# Altium schematic sheet WideRangeVoltmeter.SchDoc
size A4; SheetNumber: 1; SheetTotal: 7
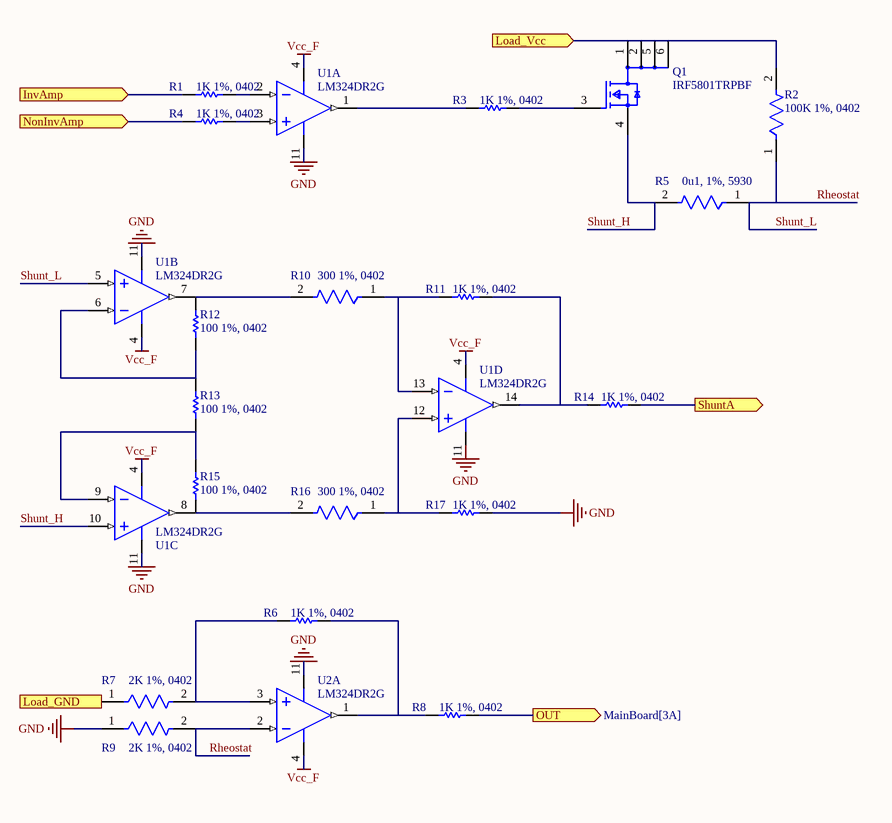
[diagram p0: WideRangeVoltmeter.SchDoc]

## Parts
Q1  IRF5801TRPBF  [FP-PG-TSOP-6-MFG]
R1  1K 1%, 0402  [RESC1005X40X25NL05T05]
R2  100K 1%, 0402  [FP-ERJ2RK-IPC_C]
R3  1K 1%, 0402  [RESC1005X40X25NL05T05]
R4  1K 1%, 0402  [RESC1005X40X25NL05T05]
R5  0u1, 1%, 5930  [FP-CSS2H-5930K-1L00F-MFG]
R6  1K 1%, 0402  [RESC1005X40X25NL05T05]
R7  2K 1%, 0402  [FP-ERJ2RK-MFG]
R8  1K 1%, 0402  [RESC1005X40X25NL05T05]
R9  2K 1%, 0402  [FP-ERJ2RK-MFG]
R10  300 1%, 0402  [FP-ERJ2RK-IPC_A]
R11  1K 1%, 0402  [RESC1005X40X25NL05T05]
R12  100 1%, 0402  [RESC1005X40X25LL05T05]
R13  100 1%, 0402  [RESC1005X40X25LL05T05]
R14  1K 1%, 0402  [RESC1005X40X25NL05T05]
R15  100 1%, 0402  [RESC1005X40X25LL05T05]
R16  300 1%, 0402  [FP-ERJ2RK-IPC_A]
R17  1K 1%, 0402  [RESC1005X40X25NL05T05]
U1  LM324DR2G  [ONSC-SOIC-14-751A-03_V]  (parts A,B,C,D of 4)
U2  LM324DR2G  [ONSC-SOIC-14-751A-03_V]  (part A of 4)

## Ports
InvAmp (in, see MainBoard[2A]), Load_GND (in, see MainBoard[3A]), Load_Vcc (in, see MainBoard[3A]), NonInvAmp (in, see MainBoard[2A]), OUT (out, see MainBoard[3A]), ShuntA (out, see MainBoard[2A])

## Nets
GND: R9.1 R17.2 U1.11(VEE/GND) U2.11(VEE/GND)
Vcc_F: U1.4(VCC) U2.4(VCC)
InvAmp: R1.1 ; port InvAmp
Load_GND: R7.1 ; port Load_GND
Load_Vcc: Q1.1(D) Q1.2(D) Q1.5(D) Q1.6(D) R2.2 ; port Load_Vcc
NonInvAmp: R4.1 ; port NonInvAmp
OUT: R8.2 ; port OUT
Rheostat: R2.1 R5.1 R9.2 U1.5(IN2+) U2.2(IN1-)  [also labelled Shunt_L]
Shunt_H: Q1.4(S) R5.2 U1.10(IN3+)
ShuntA: R14.2 ; port ShuntA
NetQ1_3: Q1.3(G) R3.2
NetR1_2: R1.2 U1.2(IN1-)
NetR3_1: R3.1 U1.1(OUT1)
NetR4_2: R4.2 U1.3(IN1+)
NetR6_1: R6.1 R7.2 U2.3(IN1+)
NetR6_2: R6.2 R8.1 U2.1(OUT1)
NetR10_1: R10.1 R11.1 U1.13(IN4-)
NetR10_2: R10.2 R12.2 U1.7(OUT2)
NetR11_2: R11.2 R14.1 U1.14(OUT4)
NetR12_1: R12.1 R13.2 U1.6(IN2-)
NetR13_1: R13.1 R15.2 U1.9(IN3-)
NetR15_1: R15.1 R16.2 U1.8(OUT3)
NetR16_1: R16.1 R17.1 U1.12(IN4+)

## Notes on the sheet
- Labels drawn without touching a wire or pin: GND

## Library data of the parts
Q1 = CMP-32901-001111-1: MOSFET N-CH 200V 600MA MICRO6; Turn-On Delay Time: 6.5ns; Power Dissipation: 2W; Rds On Max: 2.2R; Polarization: N; Input Capacitance: 88pF; Turn-Off Delay Time: 8.8ns; Threshold Voltage: 5.5V; Gate to Source Voltage (Vgs): 30V; Max Dual Supply Voltage: 200V; Mount: Surface Mount; Width: 0.067inch; RoHS Compliant: Yes; Series: HEXFET®; Packaging: Cut Tape; Drain to Source Breakdown Voltage: 200V; Length: 0.118inch; Height: 0.039inch; Number of Pins: 6; Case/Package: TSOP; Halogen Free: Halogen Free; Drain to Source Voltage (Vdss): 200V; Min Operating Temperature: -55°C; Reach SVHC Compliant: Yes; Max Operating Temperature: 150°C; Lead Free: Lead Free; Max Power Dissipation: 2W; Continuous Drain Current (ID): 600mA; Drain to Source Resistance: 2.2R
R1 R3 R4 R6 R8 R11 R14 R17 = CMP-1011-00510-4: Chip Resistor, 1 KOhm, +/- 1%, 100 mW, -55 to 155 degC, 0402 (1005 Metric), RoHS, Tape and Reel; PartNumber: ERJ-2RKF1001X; Manufacturer: Basic Passives; Voltage Rating: 50 V; Case\/Package: 0402; Resistance: 1 KOhm; Power Rating: 100 mW; DatasheetVersion: 04/2015; Radiation Hardening: No; Pins: 2; Height: 0.35 mm; RoHSCompliant: true; Case Code (Imperial): 0402; ComponentLink2Description: Datasheet; ComponentLink1Description: Manufacturer URL; PackageReference: 0402; Mount: Surface Mount; Package Quantity: 10000; Tolerance: 1%; ComponentLink1URL: http://www.panasonic.com/; PackageDescription: 2-Pin Surface Mount Device, Body 1 x 0.5 mm; Mounting Technology: Surface Mount; Case Code (Metric): 1005; ComponentLink2URL: http://industrial.panasonic.com/cdbs/www-data/pdf/RDA0000/AOA0000C86.pdf; REACH SVHC: Yes; Packaging: Tape and Reel; Max Operating Temperature: 155 degC; Min Operating Temperature: -55 degC; Width: 0.5 mm; Length: 1 mm
R2 = CMP-2002-00608-4: RES SMD 100K OHM 1% 1/10W 0402; Resistance: 100kR; Voltage Rating (DC): 50V; Power Rating: 100mW; Temperature Coefficient: 100ppm/°C; Case/Package: 0402; Length: 1mm; Package Quantity: 1; Radiation Hardening: No; Case Code (Metric): 1005; Contact Plating: Tin; Mount: Surface Mount; Depth: 0.5mm; Max Operating Temperature: 155°C; Lead Free: Lead Free; Width: 0.5mm; Composition: Thick Film; Case Code (Imperial): 0402; Tolerance: 1%; Termination: SMD/SMT; Number of Pins: 2; Height: 0.35mm; Voltage Rating: 50V; Military Standard: Not; REACH SVHC: No SVHC; Packaging: Tape and Reel; Min Operating Temperature: -55°C; Max Power Dissipation: 100mW; Features: Automotive AEC-Q200; Number of Terminations: 2
R5 = CMP-00059-73869598-1: CSS2H-5930K-1L00F Res Metal Strip 5930 0.001 Ohm 1% 9W ±50ppm/C Pad SMD Automotive T/R; Resistance: 1mΩ; Temperature Coefficient: 50ppm/°C; Case Code (Imperial): 5931; Width: 7.747mm; Min Operating Temperature: -55°C; Tolerance: 1%; Max Power Dissipation: 9W; Case Code (Metric): 1577; Max Operating Temperature: 170°C; NexarPartId: 73869598; Power Rating: 9W; Composition: Metal Element; Case/Package: 5930; Height: 939.8µm; Number of Terminations: 2; Schedule B: 8533210045, 8533210045; Packaging: Cut Tape; REACH SVHC: No SVHC; Features: Moisture Resistant; RoHS: Compliant; Length: 15.0114mm
R7 R9 = CMP-2002-00758-4: RES SMD 2K OHM 1% 1/10W 0402; Temperature Coefficient: 100ppm/°C; Max Power Dissipation: 100mW; Working Voltage: 50V; Resistance: 2kR; Number of Terminations: 2; Technology: THICK FILM; Packaging: Tape and Reel; RoHS Compliant: Yes; Min Operating Temperature: -55°C; Length: 1mm; Construction: Rectangular; Features: Automotive AEC-Q200; Contact Plating: Tin; Lead Free: Lead Free; Series: ERJ; Power Rating: 100mW; REACH SVHC: No SVHC; Resistor Type: Thick Film; Max Operating Temperature: 155°C; Package Quantity: 10000; Height: 0.35mm; Case/Package: 0402; Tolerance: 1%; Mount: Surface Mount; Termination: SMD/SMT; Resistance Tolerance: 1%; Depth: 0.5mm; Voltage Rating (DC): 50V; Voltage Rating: 50V; Case Code (Imperial): 0402; Military Standard: Not; Width: 0.02inch; Radiation Hardening: No; Case Code (Metric): 1005
R10 R16 = CMP-1011-00449-3: RES SMD 300 OHM 1% 1/10W 0402; Power Rating: 100mW; Voltage Rating: 50V; Temperature Coefficient: 100ppm/°C; Resistance: 300R; Case Code (Imperial): 0402; Termination: SMD/SMT; REACH SVHC: No SVHC; Number of Terminations: 2; Composition: Thick Film; Case Code (Metric): 1005; Voltage Rating (DC): 50V; Packaging: Tape and Reel; Max Power Dissipation: 100mW; Tolerance: 1%; Lead Free: Lead Free; Military Standard: Not; Mount: Surface Mount; Height: 0.35mm; Package Quantity: 10000; Max Operating Temperature: 155°C; Depth: 0.5mm; Min Operating Temperature: -55°C; Length: 1mm; Contact Plating: Tin; Width: 0.02inch; Case/Package: 0402
R12 R13 R15 = CMP-2002-00605-3: Chip Resistor, 100 Ohm, +/- 1%, 100 mW, -55 to 155 degC, 0402 (1005 Metric), RoHS, Tape and Reel; Manufacturer: Basic Passives; PartNumber: ERJ-2RKF1000X; Power Rating: 100 mW; Resistance: 100 Ohm; Voltage Rating: 50 V; Case\/Package: 0402; Width: 0.5 mm; Pins: 2; ComponentLink2Description: Datasheet; PackageReference: 0402; Height: 0.35 mm; Tolerance: 1%; DatasheetVersion: 04/2015; Case Code (Imperial): 0402; Min Operating Temperature: -55 degC; Radiation Hardening: No; Length: 1 mm; Package Quantity: 10000; PackageDescription: 2-Pin Surface Mount Device, Body 1 x 0.5 mm; Mounting Technology: Surface Mount; Case Code (Metric): 1005; Packaging: Tape and Reel; ComponentLink1URL: http://www.panasonic.com/; RoHSCompliant: true; Max Operating Temperature: 155 degC; REACH SVHC: Yes; ComponentLink1Description: Manufacturer URL; ComponentLink2URL: http://industrial.panasonic.com/cdbs/www-data/pdf/RDA0000/AOA0000C86.pdf; Mount: Surface Mount
U1 U2 = CMP-1310-00171-1: Single Supply Quad Operational Amplifier, 3 to 32 V, 0 to 70 degC, 14-Pin SOIC, Pb-Free, Tape and Reel; Manufacturer: On Semiconductor; VCC Max (V): 32; VCC Min (V): 3; PackageVersion: Rev. K, 05/2011; ComponentLink3URL: http://www.onsemi.com/pub_link/Collateral/751A-03.PDF; ComponentLink3Description: Package Specification; Packing: Tape and Reel; ComponentLink2URL: http://www.onsemi.cn/pub_link/Collateral/LM324-D.PDF; PackageReference: SOIC-14-751A-03; ComponentLink1URL: http://www.onsemi.com/; PackageDescription: 14-Pin Small Outline Integrated Circuit, Body 8.65 x 3.9 mm, Pitch 1.27 mm; ComponentLink1Description: Manufacturer URL; DatasheetVersion: Rev. 25; Mounting Technology: Surface Mount; RoHS: TRUE; ComponentLink2Description: Datasheet; PartNumber: LM324DR2G